# Altium schematic sheet Controller.SchDoc: Controller
size A; SheetNumber: 1; SheetTotal: 1
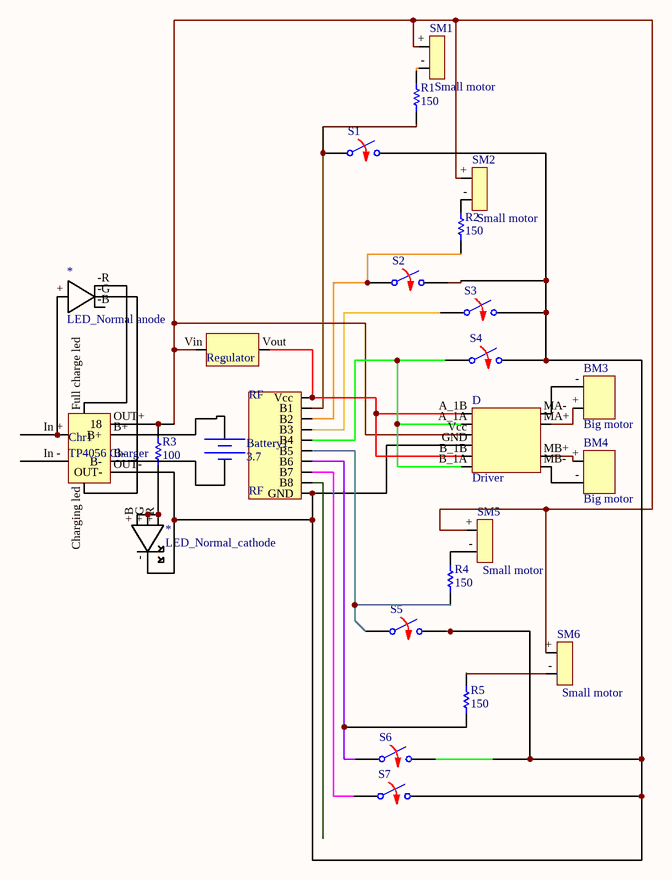
[diagram p0: Controller.SchDoc]

## Parts
(Parts that share a designator on the sheet are numbered #1, #2 ... from top to bottom, then left to right.)
*#1  LED_Normal anode
*#2  LED_Normal_cathode
Battery1  DC Magnitude: 3.7  (hidden comment: Constant Voltage Source)
BM3  Big motor
BM4  Big motor
Chr1  TP4056 Charger
D  Driver
R1  value 150  (hidden comment: Resistor)
R2  value 150  (hidden comment: Resistor)
R3  value 100  (hidden comment: Resistor)
R4  value 150  (hidden comment: Resistor)
R5  value 150  (hidden comment: Resistor)
Regulator  L?  (value not drawn)
RF  RF
S1  Switch Normally Opened  (value not drawn)
S2  Switch Normally Opened  (value not drawn)
S3  Switch Normally Opened  (value not drawn)
S4  Switch Normally Opened  (value not drawn)
S5  Switch Normally Opened  (value not drawn)
S6  Switch Normally Opened  (value not drawn)
S7  Switch Normally Opened  (value not drawn)
SM1  Small motor
SM2  Small motor
SM5  Small motor
SM6  Small motor

## Nets
Net*#1_+: *#1.+ Chr1.In_+
Net*#1_-G: *#1.-G Chr1.Charging_led
Net*#1_-R: *#1.-R Chr1.Full_charge_led
Net*#2_+B: *#2.+B *#2.+G *#2.+R R3.1
Net*#2_-: *#2.- Chr1.OUT- D.GND RF.GND S1.2 S2.2 S3.2 S4.2 S5.2 S6.2 S7.2
NetBattery1_1: Battery1.1 Chr1.B+
NetBattery1_2: Battery1.2 Chr1.B-
NetBM3_+: BM3.+ D.MA+
NetBM3_-: BM3.- D.MA-
NetBM4_+: BM4.+ D.MB+
NetBM4_-: BM4.- D.MB-
NetChr1_OUT+: Chr1.OUT+(18) D.Vcc R3.2 Regulator.Vin SM1.+ SM2.+ SM5.+ SM6.+
NetD_A_1A: D.A_1A D.B_1A RF.B4 S4.1
NetD_A_1B: D.A_1B D.B_1B Regulator.Vout RF.Vcc
NetR1_1: R1.1 SM1.-
NetR1_2: R1.2 RF.B1 S1.1
NetR2_1: R2.1 SM2.-
NetR2_2: R2.2 RF.B2 S2.1
NetR4_1: R4.1 SM5.-
NetR4_2: R4.2 RF.B5 S5.1
NetR5_1: R5.1 SM6.-
NetR5_2: R5.2 RF.B6 S6.1
NetRF_B3: RF.B3 S3.1
NetRF_B7: RF.B7 S7.1

Not connected (* = marked no-connect by the designer): *#1 -B; Chr1 In - ; RF B8

## Library data of the parts
Battery1 = Battery: SimulationGenericComponent: True
R1-R5 = Resistor: TC1: 0; SimulationGenericComponent: True; TC2: 0
Regulator = LDO
S1-S7 = SW NO: closed: 0; Rclosed: 1m; Ropen: 1Meg; SimulationGenericComponent: True